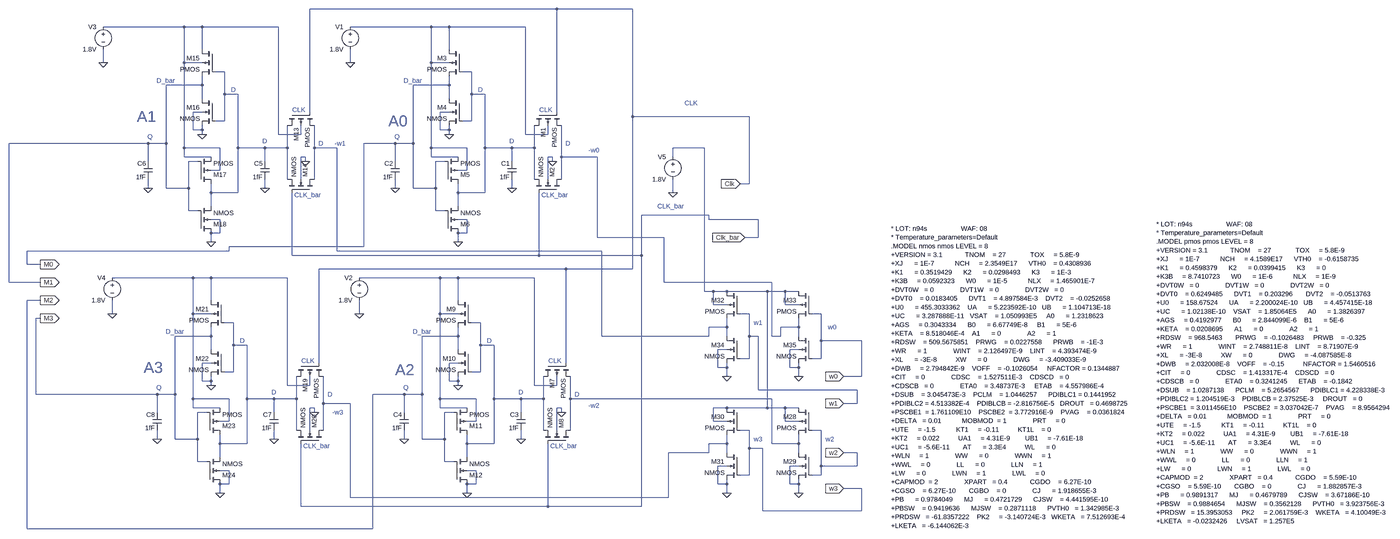
[diagram p0: schematic 4-bit_Memory.asc, whole sheet]
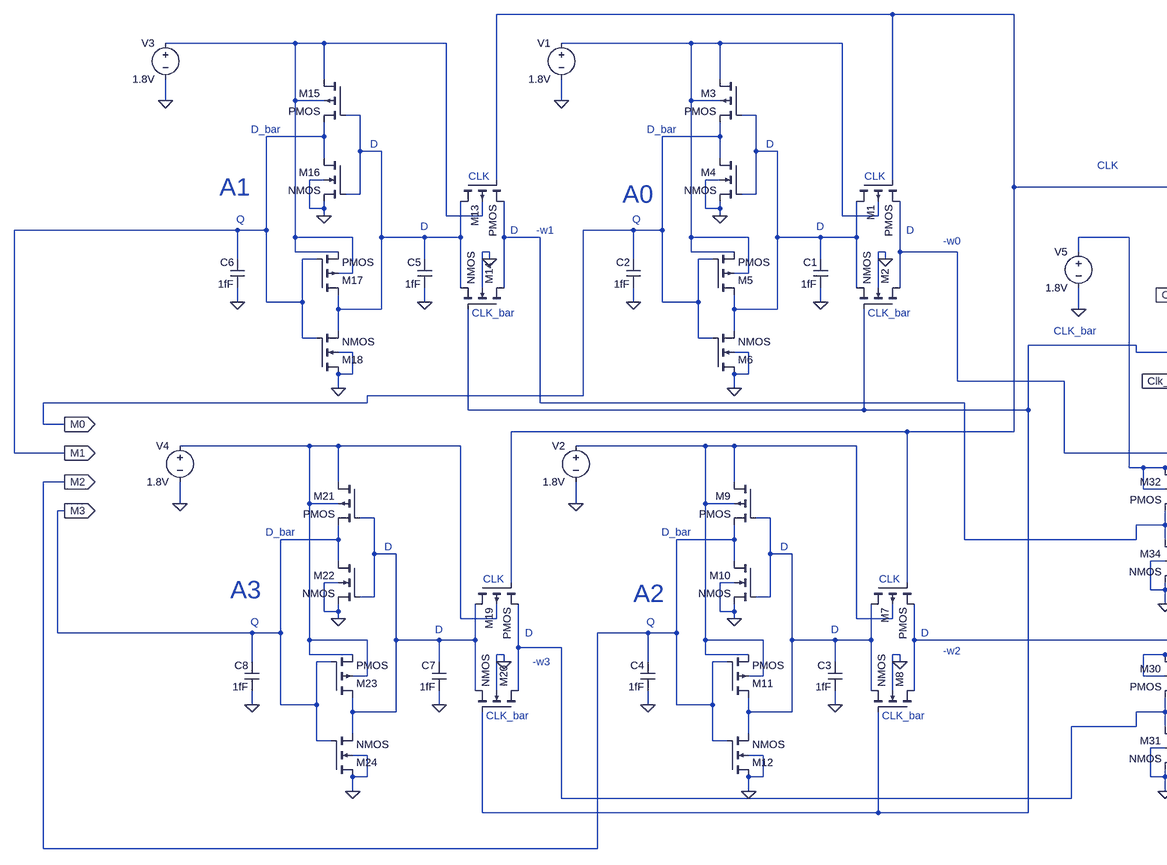
[diagram p1: schematic 4-bit_Memory.asc, part, row 1 of 1, column 1 of 2]
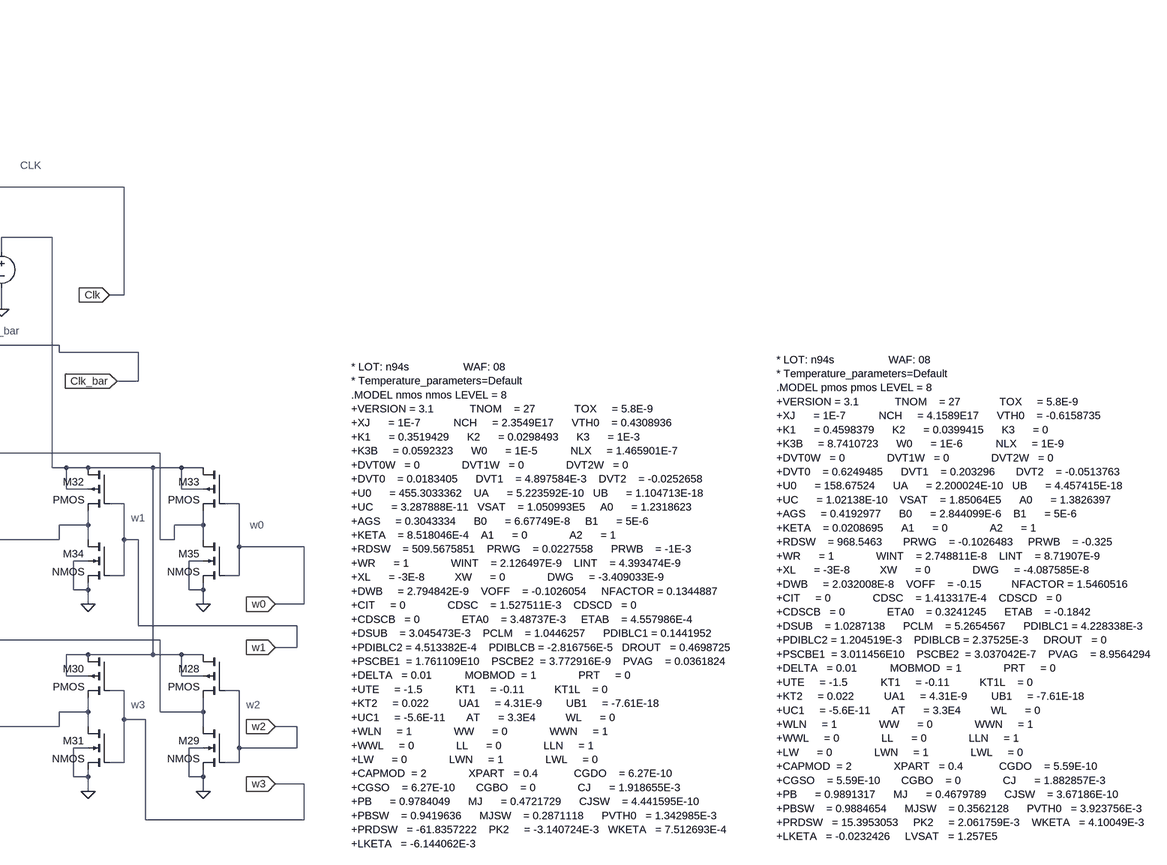
[diagram p2: schematic 4-bit_Memory.asc, part, row 1 of 1, column 2 of 2]
4-bit_Memory.asc, the LTspice schematic file:
Version 4
SHEET 1 4392 1428
WIRE 640 -432 -240 -432
WIRE 976 -432 640 -432
WIRE -688 -368 -976 -368
WIRE -624 -368 -688 -368
WIRE -352 -368 -624 -368
WIRE 192 -368 -96 -368
WIRE 256 -368 192 -368
WIRE 528 -368 256 -368
WIRE -624 -288 -624 -368
WIRE 256 -288 256 -368
WIRE -976 -240 -976 -288
WIRE -688 -240 -688 -368
WIRE -624 -240 -688 -240
WIRE -96 -240 -96 -288
WIRE 192 -240 192 -368
WIRE 256 -240 192 -240
WIRE -544 -208 -576 -208
WIRE 336 -208 304 -208
WIRE -624 -160 -624 -192
WIRE -624 -160 -752 -160
WIRE 256 -160 256 -192
WIRE 256 -160 128 -160
WIRE -544 -128 -544 -208
WIRE -496 -128 -544 -128
WIRE 336 -128 336 -208
WIRE 384 -128 336 -128
WIRE -624 -112 -624 -160
WIRE 256 -112 256 -160
WIRE -624 -64 -656 -64
WIRE -240 -64 -240 -432
WIRE 256 -64 224 -64
WIRE 640 -64 640 -432
WIRE 976 -48 976 -432
WIRE 1392 -48 976 -48
WIRE -544 -32 -544 -128
WIRE -544 -32 -576 -32
WIRE 336 -32 336 -128
WIRE 336 -32 304 -32
WIRE -656 0 -656 -64
WIRE -624 0 -624 -16
WIRE -624 0 -656 0
WIRE 224 0 224 -64
WIRE 256 0 256 -16
WIRE 256 0 224 0
WIRE -624 16 -624 0
WIRE -352 16 -352 -368
WIRE -272 16 -272 -16
WIRE -272 16 -352 16
WIRE 256 16 256 0
WIRE 528 16 528 -368
WIRE 608 16 608 -16
WIRE 608 16 528 16
WIRE -816 48 -1312 48
WIRE -752 48 -752 -160
WIRE -752 48 -816 48
WIRE 64 48 -48 48
WIRE 128 48 128 -160
WIRE 128 48 64 48
WIRE -688 64 -688 -240
WIRE -560 64 -688 64
WIRE -496 64 -496 -128
WIRE -400 64 -496 64
WIRE -320 64 -320 -16
WIRE -320 64 -400 64
WIRE -224 64 -224 -16
WIRE -144 64 -224 64
WIRE 192 64 192 -240
WIRE 320 64 192 64
WIRE 384 64 384 -128
WIRE 480 64 384 64
WIRE 560 64 560 -16
WIRE 560 64 480 64
WIRE 1232 64 1120 64
WIRE -688 96 -688 64
WIRE -592 96 -688 96
WIRE -256 96 -272 96
WIRE 192 96 192 64
WIRE 288 96 192 96
WIRE 624 96 608 96
WIRE 656 96 656 -16
WIRE 784 96 656 96
WIRE 1120 96 1120 64
WIRE -816 112 -816 48
WIRE -640 112 -672 112
WIRE -400 112 -400 64
WIRE -256 112 -256 96
WIRE 64 112 64 48
WIRE 240 112 208 112
WIRE 480 112 480 64
WIRE 624 112 624 96
WIRE -560 144 -560 64
WIRE -560 144 -592 144
WIRE 320 144 320 64
WIRE 320 144 288 144
WIRE -320 176 -320 64
WIRE -272 176 -272 96
WIRE -224 176 -224 64
WIRE 560 176 560 64
WIRE 608 176 608 96
WIRE 656 176 656 96
WIRE 1392 192 1392 -48
WIRE 1392 192 1360 192
WIRE -816 208 -816 176
WIRE -752 208 -752 48
WIRE -672 208 -672 112
WIRE -672 208 -752 208
WIRE -400 208 -400 176
WIRE 64 208 64 176
WIRE 128 208 128 48
WIRE 208 208 208 112
WIRE 208 208 128 208
WIRE 480 208 480 176
WIRE -592 224 -592 192
WIRE -496 224 -496 64
WIRE -496 224 -592 224
WIRE 288 224 288 192
WIRE 384 224 384 64
WIRE 384 224 288 224
WIRE 1120 224 1120 176
WIRE -592 272 -592 224
WIRE 288 272 288 224
WIRE -672 288 -672 208
WIRE -640 288 -672 288
WIRE 208 288 208 208
WIRE 240 288 208 288
WIRE 1248 304 1008 304
WIRE -560 320 -592 320
WIRE 320 320 288 320
WIRE 1248 320 1248 304
WIRE 1424 320 1248 320
WIRE -560 368 -560 320
WIRE -560 368 -592 368
WIRE 320 368 320 320
WIRE 320 368 288 368
WIRE 784 384 784 96
WIRE 1088 384 784 384
WIRE 1424 384 1424 320
WIRE 1424 384 1376 384
WIRE -592 400 -592 368
WIRE 288 400 288 368
WIRE -48 416 -48 48
WIRE -48 416 -528 416
WIRE -528 432 -528 416
WIRE -528 432 -1248 432
WIRE -144 432 -144 64
WIRE 800 432 -144 432
WIRE -304 448 -304 224
WIRE 576 448 576 224
WIRE 576 448 -304 448
WIRE 1008 448 1008 304
WIRE 1008 448 576 448
WIRE -1248 480 -1248 432
WIRE -1200 480 -1248 480
WIRE 672 496 -208 496
WIRE 976 496 976 -48
WIRE 976 496 672 496
WIRE -656 528 -944 528
WIRE -592 528 -656 528
WIRE -320 528 -592 528
WIRE 224 528 -64 528
WIRE 288 528 224 528
WIRE 560 528 288 528
WIRE -1312 544 -1312 48
WIRE -1200 544 -1312 544
WIRE 1088 544 1088 384
WIRE 1472 544 1088 544
WIRE 1232 576 1232 64
WIRE 1264 576 1232 576
WIRE 1312 576 1264 576
WIRE 1456 576 1312 576
WIRE 1520 576 1456 576
WIRE 1568 576 1520 576
WIRE -1200 608 -1248 608
WIRE -592 608 -592 528
WIRE 288 608 288 528
WIRE 1264 624 1264 576
WIRE 1312 624 1264 624
WIRE 1520 624 1520 576
WIRE 1568 624 1520 624
WIRE -944 656 -944 608
WIRE -656 656 -656 528
WIRE -592 656 -656 656
WIRE -64 656 -64 608
WIRE 224 656 224 528
WIRE 288 656 224 656
WIRE 1392 656 1360 656
WIRE 1648 656 1616 656
WIRE -1200 672 -1216 672
WIRE -512 688 -544 688
WIRE 368 688 336 688
WIRE 1312 704 1312 672
WIRE 1312 704 1248 704
WIRE 1568 704 1568 672
WIRE 1568 704 1504 704
WIRE -592 736 -592 704
WIRE -592 736 -720 736
WIRE 288 736 288 704
WIRE 288 736 160 736
WIRE 800 736 800 432
WIRE 1248 736 1248 704
WIRE 1248 736 800 736
WIRE 1312 736 1312 704
WIRE 1392 736 1392 656
WIRE 1424 736 1392 736
WIRE 1472 736 1472 544
WIRE 1504 736 1504 704
WIRE 1504 736 1472 736
WIRE 1568 736 1568 704
WIRE 1648 752 1648 656
WIRE 1792 752 1648 752
WIRE -512 768 -512 688
WIRE -464 768 -512 768
WIRE 368 768 368 688
WIRE 416 768 368 768
WIRE -592 784 -592 736
WIRE 288 784 288 736
WIRE 1312 784 1280 784
WIRE 1568 784 1536 784
WIRE 1392 816 1392 736
WIRE 1392 816 1360 816
WIRE 1648 816 1648 752
WIRE 1648 816 1616 816
WIRE -592 832 -624 832
WIRE -208 832 -208 496
WIRE 288 832 256 832
WIRE 672 832 672 496
WIRE 1280 848 1280 784
WIRE 1312 848 1312 832
WIRE 1312 848 1280 848
WIRE 1536 848 1536 784
WIRE 1568 848 1568 832
WIRE 1568 848 1536 848
WIRE -512 864 -512 768
WIRE -512 864 -544 864
WIRE 368 864 368 768
WIRE 368 864 336 864
WIRE 1312 880 1312 848
WIRE 1568 880 1568 848
WIRE 1792 880 1792 752
WIRE 1792 880 1728 880
WIRE -624 896 -624 832
WIRE -592 896 -592 880
WIRE -592 896 -624 896
WIRE 256 896 256 832
WIRE 288 896 288 880
WIRE 288 896 256 896
WIRE -592 912 -592 896
WIRE -320 912 -320 528
WIRE -240 912 -240 880
WIRE -240 912 -320 912
WIRE 288 912 288 896
WIRE 560 912 560 528
WIRE 640 912 640 880
WIRE 640 912 560 912
WIRE 1424 928 1424 736
WIRE 1776 928 1424 928
WIRE -1216 944 -1216 672
WIRE -784 944 -1216 944
WIRE -720 944 -720 736
WIRE -720 944 -784 944
WIRE 96 944 -16 944
WIRE 160 944 160 736
WIRE 160 944 96 944
WIRE -656 960 -656 656
WIRE -528 960 -656 960
WIRE -464 960 -464 768
WIRE -368 960 -464 960
WIRE -288 960 -288 880
WIRE -288 960 -368 960
WIRE 224 960 224 656
WIRE 352 960 224 960
WIRE 416 960 416 768
WIRE 512 960 416 960
WIRE 592 960 592 880
WIRE 592 960 512 960
WIRE 688 960 688 880
WIRE 1472 960 688 960
WIRE -192 976 -192 880
WIRE -96 976 -192 976
WIRE 1776 976 1776 928
WIRE 1776 976 1728 976
WIRE -656 992 -656 960
WIRE -560 992 -656 992
WIRE -224 992 -240 992
WIRE 224 992 224 960
WIRE 320 992 224 992
WIRE 656 992 640 992
WIRE 1312 992 1264 992
WIRE 1456 992 1456 576
WIRE 1456 992 1312 992
WIRE 1520 992 1456 992
WIRE 1568 992 1520 992
WIRE -784 1008 -784 944
WIRE -608 1008 -640 1008
WIRE -368 1008 -368 960
WIRE -224 1008 -224 992
WIRE 96 1008 96 944
WIRE 272 1008 240 1008
WIRE 512 1008 512 960
WIRE 656 1008 656 992
WIRE -528 1040 -528 960
WIRE -528 1040 -560 1040
WIRE 352 1040 352 960
WIRE 352 1040 320 1040
WIRE 1264 1040 1264 992
WIRE 1312 1040 1264 1040
WIRE 1520 1040 1520 992
WIRE 1568 1040 1520 1040
WIRE -288 1072 -288 960
WIRE -240 1072 -240 992
WIRE -192 1072 -192 976
WIRE 592 1072 592 960
WIRE 640 1072 640 992
WIRE 688 1072 688 960
WIRE 1392 1072 1360 1072
WIRE 1648 1072 1616 1072
WIRE -784 1104 -784 1072
WIRE -720 1104 -720 944
WIRE -640 1104 -640 1008
WIRE -640 1104 -720 1104
WIRE -368 1104 -368 1072
WIRE 96 1104 96 1072
WIRE 160 1104 160 944
WIRE 240 1104 240 1008
WIRE 240 1104 160 1104
WIRE 512 1104 512 1072
WIRE -560 1120 -560 1088
WIRE -464 1120 -464 960
WIRE -464 1120 -560 1120
WIRE 320 1120 320 1088
WIRE 416 1120 416 960
WIRE 416 1120 320 1120
WIRE 1312 1120 1312 1088
WIRE 1312 1120 1248 1120
WIRE 1472 1120 1472 960
WIRE 1568 1120 1568 1088
WIRE 1568 1120 1472 1120
WIRE 1392 1136 1392 1072
WIRE 1440 1136 1392 1136
WIRE 1248 1152 1248 1120
WIRE 1248 1152 1104 1152
WIRE 1312 1152 1312 1120
WIRE 1568 1152 1568 1120
WIRE 1776 1152 1728 1152
WIRE -560 1168 -560 1120
WIRE 320 1168 320 1120
WIRE -640 1184 -640 1104
WIRE -608 1184 -640 1184
WIRE 240 1184 240 1104
WIRE 272 1184 240 1184
WIRE 1312 1200 1280 1200
WIRE 1568 1200 1536 1200
WIRE 1648 1200 1648 1072
WIRE 1776 1200 1776 1152
WIRE 1776 1200 1648 1200
WIRE -528 1216 -560 1216
WIRE 352 1216 320 1216
WIRE 1392 1232 1392 1136
WIRE 1392 1232 1360 1232
WIRE 1648 1232 1648 1200
WIRE 1648 1232 1616 1232
WIRE -528 1264 -528 1216
WIRE -528 1264 -560 1264
WIRE 352 1264 352 1216
WIRE 352 1264 320 1264
WIRE 1280 1264 1280 1200
WIRE 1312 1264 1312 1248
WIRE 1312 1264 1280 1264
WIRE 1536 1264 1536 1200
WIRE 1568 1264 1568 1248
WIRE 1568 1264 1536 1264
WIRE 1792 1280 1728 1280
WIRE -560 1296 -560 1264
WIRE 320 1296 320 1264
WIRE 1312 1296 1312 1264
WIRE 1568 1296 1568 1264
WIRE -96 1312 -96 976
WIRE 1104 1312 1104 1152
WIRE 1104 1312 -96 1312
WIRE -272 1344 -272 1120
WIRE 608 1344 608 1120
WIRE 608 1344 -272 1344
WIRE 1008 1344 1008 448
WIRE 1008 1344 608 1344
WIRE 1440 1360 1440 1136
WIRE 1792 1360 1792 1280
WIRE 1792 1360 1440 1360
WIRE -1248 1424 -1248 608
WIRE -16 1424 -16 944
WIRE -16 1424 -1248 1424
FLAG -96 -240 0
FLAG 256 16 0
FLAG 288 400 0
FLAG 624 112 0
FLAG 480 208 0
FLAG 64 208 0
FLAG -64 656 0
FLAG 288 912 0
FLAG 320 1296 0
FLAG 656 1008 0
FLAG 512 1104 0
FLAG 96 1104 0
FLAG -976 -240 0
FLAG -624 16 0
FLAG -592 400 0
FLAG -256 112 0
FLAG -400 208 0
FLAG -816 208 0
FLAG -944 656 0
FLAG -592 912 0
FLAG -560 1296 0
FLAG -224 1008 0
FLAG -368 1104 0
FLAG -784 1104 0
FLAG 1120 224 0
FLAG 1312 880 0
FLAG 1568 880 0
FLAG 1312 1296 0
FLAG 1568 1296 0
FLAG 1360 192 Clk
IOPIN 1360 192 In
FLAG 1376 384 Clk_bar
IOPIN 1376 384 In
FLAG 1728 880 w0
IOPIN 1728 880 In
FLAG 1728 976 w1
IOPIN 1728 976 In
FLAG 1728 1152 w2
IOPIN 1728 1152 In
FLAG 1728 1280 w3
IOPIN 1728 1280 In
FLAG -1200 480 M0
IOPIN -1200 480 Out
FLAG -1200 544 M1
IOPIN -1200 544 Out
FLAG -1200 608 M2
IOPIN -1200 608 Out
FLAG -1200 672 M3
IOPIN -1200 672 Out
SYMBOL pmos4 560 -64 M90
SYMATTR InstName M1
SYMATTR Value2 l=180n w=6000n
SYMBOL nmos4 656 224 M270
SYMATTR InstName M2
SYMATTR Value2 l=180n w=6000n
SYMBOL pmos4 304 -288 M0
SYMATTR InstName M3
SYMATTR Value2 l=180n w=3520n
SYMBOL nmos4 304 -112 M0
SYMATTR InstName M4
SYMATTR Value2 l=180n w=1760n
SYMBOL pmos4 240 192 M180
SYMATTR InstName M5
SYMATTR Value2 l=180n w=880n
SYMBOL nmos4 240 368 M180
SYMATTR InstName M6
SYMATTR Value2 l=180n w=440n
SYMBOL voltage -96 -384 M0
WINDOW 123 0 0 Left 0
WINDOW 39 0 0 Left 0
SYMATTR InstName V1
SYMATTR Value 1.8V
SYMBOL cap 496 112 M0
SYMATTR InstName C1
SYMATTR Value 1fF
SYMBOL cap 80 112 M0
SYMATTR InstName C2
SYMATTR Value 1fF
SYMBOL pmos4 592 832 M90
SYMATTR InstName M7
SYMATTR Value2 l=180n w=6000n
SYMBOL nmos4 688 1120 M270
SYMATTR InstName M8
SYMATTR Value2 l=180n w=6000n
SYMBOL pmos4 336 608 M0
SYMATTR InstName M9
SYMATTR Value2 l=180n w=3520n
SYMBOL nmos4 336 784 M0
SYMATTR InstName M10
SYMATTR Value2 l=180n w=1760n
SYMBOL pmos4 272 1088 M180
SYMATTR InstName M11
SYMATTR Value2 l=180n w=880n
SYMBOL nmos4 272 1264 M180
SYMATTR InstName M12
SYMATTR Value2 l=180n w=440n
SYMBOL voltage -64 512 M0
WINDOW 123 0 0 Left 0
WINDOW 39 0 0 Left 0
SYMATTR InstName V2
SYMATTR Value 1.8V
SYMBOL cap 528 1008 M0
SYMATTR InstName C3
SYMATTR Value 1fF
SYMBOL cap 112 1008 M0
SYMATTR InstName C4
SYMATTR Value 1fF
SYMBOL pmos4 -320 -64 M90
SYMATTR InstName M13
SYMATTR Value2 l=180n w=6000n
SYMBOL nmos4 -224 224 M270
SYMATTR InstName M14
SYMATTR Value2 l=180n w=6000n
SYMBOL pmos4 -576 -288 M0
SYMATTR InstName M15
SYMATTR Value2 l=180n w=3520n
SYMBOL nmos4 -576 -112 M0
SYMATTR InstName M16
SYMATTR Value2 l=180n w=1760n
SYMBOL pmos4 -640 192 M180
SYMATTR InstName M17
SYMATTR Value2 l=180n w=880n
SYMBOL nmos4 -640 368 M180
SYMATTR InstName M18
SYMATTR Value2 l=180n w=440n
SYMBOL voltage -976 -384 M0
WINDOW 123 0 0 Left 0
WINDOW 39 0 0 Left 0
SYMATTR InstName V3
SYMATTR Value 1.8V
SYMBOL cap -384 112 M0
SYMATTR InstName C5
SYMATTR Value 1fF
SYMBOL cap -800 112 M0
SYMATTR InstName C6
SYMATTR Value 1fF
SYMBOL pmos4 -288 832 M90
SYMATTR InstName M19
SYMATTR Value2 l=180n w=6000n
SYMBOL nmos4 -192 1120 M270
SYMATTR InstName M20
SYMATTR Value2 l=180n w=6000n
SYMBOL pmos4 -544 608 M0
SYMATTR InstName M21
SYMATTR Value2 l=180n w=3520n
SYMBOL nmos4 -544 784 M0
SYMATTR InstName M22
SYMATTR Value2 l=180n w=1760n
SYMBOL pmos4 -608 1088 M180
SYMATTR InstName M23
SYMATTR Value2 l=180n w=880n
SYMBOL nmos4 -608 1264 M180
SYMATTR InstName M24
SYMATTR Value2 l=180n w=440n
SYMBOL voltage -944 512 M0
WINDOW 123 0 0 Left 0
WINDOW 39 0 0 Left 0
SYMATTR InstName V4
SYMATTR Value 1.8V
SYMBOL cap -352 1008 M0
SYMATTR InstName C7
SYMATTR Value 1fF
SYMBOL cap -768 1008 M0
SYMATTR InstName C8
SYMATTR Value 1fF
SYMBOL voltage 1120 80 M0
WINDOW 123 0 0 Left 0
WINDOW 39 0 0 Left 0
SYMATTR InstName V5
SYMATTR Value 1.8V
SYMBOL pmos4 1616 992 M0
SYMATTR InstName M28
SYMATTR Value2 l=180n w=4000n
SYMBOL nmos4 1616 1152 M0
SYMATTR InstName M29
SYMATTR Value2 l=180n w=2000n
SYMBOL pmos4 1360 992 M0
SYMATTR InstName M30
SYMATTR Value2 l=180n w=4000n
SYMBOL nmos4 1360 1152 M0
SYMATTR InstName M31
SYMATTR Value2 l=180n w=2000n
SYMBOL pmos4 1360 576 M0
SYMATTR InstName M32
SYMATTR Value2 l=180n w=4000n
SYMBOL pmos4 1616 576 M0
SYMATTR InstName M33
SYMATTR Value2 l=180n w=4000n
SYMBOL nmos4 1360 736 M0
SYMATTR InstName M34
SYMATTR Value2 l=180n w=2000n
SYMBOL nmos4 1616 736 M0
SYMATTR InstName M35
SYMATTR Value2 l=180n w=2000n
TEXT 624 -72 Right 2 ;CLK
TEXT 680 232 Right 2 ;CLK_bar
TEXT 160 -176 Right 2 ;D_bar
TEXT 376 -144 Right 2 ;D
TEXT 488 40 Right 2 ;D
TEXT 80 24 Right 2 ;Q
TEXT 688 48 Right 2 ;D
TEXT 656 824 Right 2 ;CLK
TEXT 712 1128 Right 2 ;CLK_bar
TEXT 192 720 Right 2 ;D_bar
TEXT 408 752 Right 2 ;D
TEXT 520 936 Right 2 ;D
TEXT 112 920 Right 2 ;Q
TEXT 720 944 Right 2 ;D
TEXT -256 -72 Right 2 ;CLK
TEXT -200 232 Right 2 ;CLK_bar
TEXT -720 -176 Right 2 ;D_bar
TEXT -504 -144 Right 2 ;D
TEXT -392 40 Right 2 ;D
TEXT -800 24 Right 2 ;Q
TEXT -192 48 Right 2 ;D
TEXT -224 824 Right 2 ;CLK
TEXT -168 1128 Right 2 ;CLK_bar
TEXT -688 720 Right 2 ;D_bar
TEXT -472 752 Right 2 ;D
TEXT -360 936 Right 2 ;D
TEXT -768 920 Right 2 ;Q
TEXT -160 944 Right 2 ;D
TEXT 1208 -96 Right 2 ;CLK
TEXT 1160 272 Right 2 ;CLK_bar
TEXT 40 -32 Left 5 ;A0
TEXT 1672 704 Left 2 ;w0
TEXT 1408 688 Left 2 ;w1
TEXT 1664 1104 Left 2 ;w2
TEXT 1408 1104 Left 2 ;w3
TEXT -856 -48 Left 5 ;A1
TEXT 64 856 Left 5 ;A2
TEXT -832 848 Left 5 ;A3
TEXT 752 72 Left 2 ;-w0
TEXT -152 48 Left 2 ;-w1
TEXT 752 984 Left 2 ;-w2
TEXT -160 1008 Left 2 ;-w3
TEXT 2552 352 Left 2 !* LOT: n94s                  WAF: 08\n* Temperature_parameters=Default\n.MODEL nmos nmos LEVEL = 8\n+VERSION = 3.1            TNOM    = 27             TOX     = 5.8E-9\n+XJ      = 1E-7           NCH     = 2.3549E17      VTH0    = 0.4308936\n+K1      = 0.3519429      K2      = 0.0298493      K3      = 1E-3\n+K3B     = 0.0592323      W0      = 1E-5           NLX     = 1.465901E-7\n+DVT0W   = 0              DVT1W   = 0              DVT2W   = 0\n+DVT0    = 0.0183405      DVT1    = 4.897584E-3    DVT2    = -0.0252658\n+U0      = 455.3033362    UA      = 5.223592E-10   UB      = 1.104713E-18\n+UC      = 3.287888E-11   VSAT    = 1.050993E5     A0      = 1.2318623\n+AGS     = 0.3043334      B0      = 6.67749E-8     B1      = 5E-6\n+KETA    = 8.518046E-4    A1      = 0              A2      = 1\n+RDSW    = 509.5675851    PRWG    = 0.0227558      PRWB    = -1E-3\n+WR      = 1              WINT    = 2.126497E-9    LINT    = 4.393474E-9\n+XL      = -3E-8          XW      = 0              DWG     = -3.409033E-9\n+DWB     = 2.794842E-9    VOFF    = -0.1026054     NFACTOR = 0.1344887\n+CIT     = 0              CDSC    = 1.527511E-3    CDSCD   = 0\n+CDSCB   = 0              ETA0    = 3.48737E-3     ETAB    = 4.557986E-4\n+DSUB    = 3.045473E-3    PCLM    = 1.0446257      PDIBLC1 = 0.1441952\n+PDIBLC2 = 4.513382E-4    PDIBLCB = -2.816756E-5   DROUT   = 0.4698725\n+PSCBE1  = 1.761109E10    PSCBE2  = 3.772916E-9    PVAG    = 0.0361824\n+DELTA   = 0.01           MOBMOD  = 1              PRT     = 0\n+UTE     = -1.5           KT1     = -0.11          KT1L    = 0\n+KT2     = 0.022          UA1     = 4.31E-9        UB1     = -7.61E-18\n+UC1     = -5.6E-11       AT      = 3.3E4          WL      = 0\n+WLN     = 1              WW      = 0              WWN     = 1\n+WWL     = 0              LL      = 0              LLN     = 1\n+LW      = 0              LWN     = 1              LWL     = 0\n+CAPMOD  = 2              XPART   = 0.4            CGDO    = 6.27E-10\n+CGSO    = 6.27E-10       CGBO    = 0              CJ      = 1.918655E-3\n+PB      = 0.9784049      MJ      = 0.4721729      CJSW    = 4.441595E-10\n+PBSW    = 0.9419636      MJSW    = 0.2871118      PVTH0   = 1.342985E-3\n+PRDSW   = -61.8357222    PK2     = -3.140724E-3   WKETA   = 7.512693E-4\n+LKETA   = -6.144062E-3
TEXT 3512 336 Left 2 !* LOT: n94s                  WAF: 08\n* Temperature_parameters=Default\n.MODEL pmos pmos LEVEL = 8\n+VERSION = 3.1            TNOM    = 27             TOX     = 5.8E-9\n+XJ      = 1E-7           NCH     = 4.1589E17      VTH0    = -0.6158735\n+K1      = 0.4598379      K2      = 0.0399415      K3      = 0\n+K3B     = 8.7410723      W0      = 1E-6           NLX     = 1E-9\n+DVT0W   = 0              DVT1W   = 0              DVT2W   = 0\n+DVT0    = 0.6249485      DVT1    = 0.203296       DVT2    = -0.0513763\n+U0      = 158.67524      UA      = 2.200024E-10   UB      = 4.457415E-18\n+UC      = 1.02138E-10    VSAT    = 1.85064E5      A0      = 1.3826397\n+AGS     = 0.4192977      B0      = 2.844099E-6    B1      = 5E-6\n+KETA    = 0.0208695      A1      = 0              A2      = 1\n+RDSW    = 968.5463       PRWG    = -0.1026483     PRWB    = -0.325\n+WR      = 1              WINT    = 2.748811E-8    LINT    = 8.71907E-9\n+XL      = -3E-8          XW      = 0              DWG     = -4.087585E-8\n+DWB     = 2.032008E-8    VOFF    = -0.15          NFACTOR = 1.5460516\n+CIT     = 0              CDSC    = 1.413317E-4    CDSCD   = 0\n+CDSCB   = 0              ETA0    = 0.3241245      ETAB    = -0.1842\n+DSUB    = 1.0287138      PCLM    = 5.2654567      PDIBLC1 = 4.228338E-3\n+PDIBLC2 = 1.204519E-3    PDIBLCB = 2.37525E-3     DROUT   = 0\n+PSCBE1  = 3.011456E10    PSCBE2  = 3.037042E-7    PVAG    = 8.9564294\n+DELTA   = 0.01           MOBMOD  = 1              PRT     = 0\n+UTE     = -1.5           KT1     = -0.11          KT1L    = 0\n+KT2     = 0.022          UA1     = 4.31E-9        UB1     = -7.61E-18\n+UC1     = -5.6E-11       AT      = 3.3E4          WL      = 0\n+WLN     = 1              WW      = 0              WWN     = 1\n+WWL     = 0              LL      = 0              LLN     = 1\n+LW      = 0              LWN     = 1              LWL     = 0\n+CAPMOD  = 2              XPART   = 0.4            CGDO    = 5.59E-10\n+CGSO    = 5.59E-10       CGBO    = 0              CJ      = 1.882857E-3\n+PB      = 0.9891317      MJ      = 0.4679789      CJSW    = 3.67186E-10\n+PBSW    = 0.9884654      MJSW    = 0.3562128      PVTH0   = 3.923756E-3\n+PRDSW   = 15.3953053     PK2     = 2.061759E-3    WKETA   = 4.10049E-3\n+LKETA   = -0.0232426     LVSAT   = 1.257E5

The netlist it stands for:
* 4-bit_Memory.asc
M1 N004 Clk N007 N002 PMOS l=180n w=6000n
M2 N007 Clk_bar N004 0 NMOS l=180n w=6000n
M3 N002 N004 M0 N002 PMOS l=180n w=3520n
M4 M0 N004 0 0 NMOS l=180n w=1760n
M5 N004 M0 N002 N002 PMOS l=180n w=880n
M6 0 M0 N004 0 NMOS l=180n w=440n
V1 N002 0 1.8V
C1 N004 0 1fF
C2 M0 0 1fF
M7 N011 Clk N012 N009 PMOS l=180n w=6000n
M8 N012 Clk_bar N011 0 NMOS l=180n w=6000n
M9 N009 N011 M2 N009 PMOS l=180n w=3520n
M10 M2 N011 0 0 NMOS l=180n w=1760n
M11 N011 M2 N009 N009 PMOS l=180n w=880n
M12 0 M2 N011 0 NMOS l=180n w=440n
V2 N009 0 1.8V
C3 N011 0 1fF
C4 M2 0 1fF
M13 N003 Clk N005 N001 PMOS l=180n w=6000n
M14 N005 Clk_bar N003 0 NMOS l=180n w=6000n
M15 N001 N003 M1 N001 PMOS l=180n w=3520n
M16 M1 N003 0 0 NMOS l=180n w=1760n
M17 N003 M1 N001 N001 PMOS l=180n w=880n
M18 0 M1 N003 0 NMOS l=180n w=440n
V3 N001 0 1.8V
C5 N003 0 1fF
C6 M1 0 1fF
M19 N010 Clk N013 N008 PMOS l=180n w=6000n
M20 N013 Clk_bar N010 0 NMOS l=180n w=6000n
M21 N008 N010 M3 N008 PMOS l=180n w=3520n
M22 M3 N010 0 0 NMOS l=180n w=1760n
M23 N010 M3 N008 N008 PMOS l=180n w=880n
M24 0 M3 N010 0 NMOS l=180n w=440n
V4 N008 0 1.8V
C7 N010 0 1fF
C8 M3 0 1fF
V5 N006 0 1.8V
M28 N006 w2 N012 N006 PMOS l=180n w=4000n
M29 N012 w2 0 0 NMOS l=180n w=2000n
M30 N006 w3 N013 N006 PMOS l=180n w=4000n
M31 N013 w3 0 0 NMOS l=180n w=2000n
M32 N006 w1 N005 N006 PMOS l=180n w=4000n
M33 N006 w0 N007 N006 PMOS l=180n w=4000n
M34 N005 w1 0 0 NMOS l=180n w=2000n
M35 N007 w0 0 0 NMOS l=180n w=2000n
.model NMOS NMOS
.model PMOS PMOS
.lib standard.mos
* CLK
* CLK_bar
* D_bar
* D
* D
* Q
* D
* CLK
* CLK_bar
* D_bar
* D
* D
* Q
* D
* CLK
* CLK_bar
* D_bar
* D
* D
* Q
* D
* CLK
* CLK_bar
* D_bar
* D
* D
* Q
* D
* CLK
* CLK_bar
* A0
* w0
* w1
* w2
* w3
* A1
* A2
* A3
* -w0
* -w1
* -w2
* -w3
* LOT: n94s                  WAF: 08
* Temperature_parameters=Default
.MODEL nmos nmos LEVEL = 8
+VERSION = 3.1            TNOM    = 27             TOX     = 5.8E-9
+XJ      = 1E-7           NCH     = 2.3549E17      VTH0    = 0.4308936
+K1      = 0.3519429      K2      = 0.0298493      K3      = 1E-3
+K3B     = 0.0592323      W0      = 1E-5           NLX     = 1.465901E-7
+DVT0W   = 0              DVT1W   = 0              DVT2W   = 0
+DVT0    = 0.0183405      DVT1    = 4.897584E-3    DVT2    = -0.0252658
+U0      = 455.3033362    UA      = 5.223592E-10   UB      = 1.104713E-18
+UC      = 3.287888E-11   VSAT    = 1.050993E5     A0      = 1.2318623
+AGS     = 0.3043334      B0      = 6.67749E-8     B1      = 5E-6
+KETA    = 8.518046E-4    A1      = 0              A2      = 1
+RDSW    = 509.5675851    PRWG    = 0.0227558      PRWB    = -1E-3
+WR      = 1              WINT    = 2.126497E-9    LINT    = 4.393474E-9
+XL      = -3E-8          XW      = 0              DWG     = -3.409033E-9
+DWB     = 2.794842E-9    VOFF    = -0.1026054     NFACTOR = 0.1344887
+CIT     = 0              CDSC    = 1.527511E-3    CDSCD   = 0
+CDSCB   = 0              ETA0    = 3.48737E-3     ETAB    = 4.557986E-4
+DSUB    = 3.045473E-3    PCLM    = 1.0446257      PDIBLC1 = 0.1441952
+PDIBLC2 = 4.513382E-4    PDIBLCB = -2.816756E-5   DROUT   = 0.4698725
+PSCBE1  = 1.761109E10    PSCBE2  = 3.772916E-9    PVAG    = 0.0361824
+DELTA   = 0.01           MOBMOD  = 1              PRT     = 0
+UTE     = -1.5           KT1     = -0.11          KT1L    = 0
+KT2     = 0.022          UA1     = 4.31E-9        UB1     = -7.61E-18
+UC1     = -5.6E-11       AT      = 3.3E4          WL      = 0
+WLN     = 1              WW      = 0              WWN     = 1
+WWL     = 0              LL      = 0              LLN     = 1
+LW      = 0              LWN     = 1              LWL     = 0
+CAPMOD  = 2              XPART   = 0.4            CGDO    = 6.27E-10
+CGSO    = 6.27E-10       CGBO    = 0              CJ      = 1.918655E-3
+PB      = 0.9784049      MJ      = 0.4721729      CJSW    = 4.441595E-10
+PBSW    = 0.9419636      MJSW    = 0.2871118      PVTH0   = 1.342985E-3
+PRDSW   = -61.8357222    PK2     = -3.140724E-3   WKETA   = 7.512693E-4
+LKETA   = -6.144062E-3
* LOT: n94s                  WAF: 08
* Temperature_parameters=Default
.MODEL pmos pmos LEVEL = 8
+VERSION = 3.1            TNOM    = 27             TOX     = 5.8E-9
+XJ      = 1E-7           NCH     = 4.1589E17      VTH0    = -0.6158735
+K1      = 0.4598379      K2      = 0.0399415      K3      = 0
+K3B     = 8.7410723      W0      = 1E-6           NLX     = 1E-9
+DVT0W   = 0              DVT1W   = 0              DVT2W   = 0
+DVT0    = 0.6249485      DVT1    = 0.203296       DVT2    = -0.0513763
+U0      = 158.67524      UA      = 2.200024E-10   UB      = 4.457415E-18
+UC      = 1.02138E-10    VSAT    = 1.85064E5      A0      = 1.3826397
+AGS     = 0.4192977      B0      = 2.844099E-6    B1      = 5E-6
+KETA    = 0.0208695      A1      = 0              A2      = 1
+RDSW    = 968.5463       PRWG    = -0.1026483     PRWB    = -0.325
+WR      = 1              WINT    = 2.748811E-8    LINT    = 8.71907E-9
+XL      = -3E-8          XW      = 0              DWG     = -4.087585E-8
+DWB     = 2.032008E-8    VOFF    = -0.15          NFACTOR = 1.5460516
+CIT     = 0              CDSC    = 1.413317E-4    CDSCD   = 0
+CDSCB   = 0              ETA0    = 0.3241245      ETAB    = -0.1842
+DSUB    = 1.0287138      PCLM    = 5.2654567      PDIBLC1 = 4.228338E-3
+PDIBLC2 = 1.204519E-3    PDIBLCB = 2.37525E-3     DROUT   = 0
+PSCBE1  = 3.011456E10    PSCBE2  = 3.037042E-7    PVAG    = 8.9564294
+DELTA   = 0.01           MOBMOD  = 1              PRT     = 0
+UTE     = -1.5           KT1     = -0.11          KT1L    = 0
+KT2     = 0.022          UA1     = 4.31E-9        UB1     = -7.61E-18
+UC1     = -5.6E-11       AT      = 3.3E4          WL      = 0
+WLN     = 1              WW      = 0              WWN     = 1
+WWL     = 0              LL      = 0              LLN     = 1
+LW      = 0              LWN     = 1              LWL     = 0
+CAPMOD  = 2              XPART   = 0.4            CGDO    = 5.59E-10
+CGSO    = 5.59E-10       CGBO    = 0              CJ      = 1.882857E-3
+PB      = 0.9891317      MJ      = 0.4679789      CJSW    = 3.67186E-10
+PBSW    = 0.9884654      MJSW    = 0.3562128      PVTH0   = 3.923756E-3
+PRDSW   = 15.3953053     PK2     = 2.061759E-3    WKETA   = 4.10049E-3
+LKETA   = -0.0232426     LVSAT   = 1.257E5
.backanno
.end